# Altium schematic sheet MCU.SchDoc
size A3
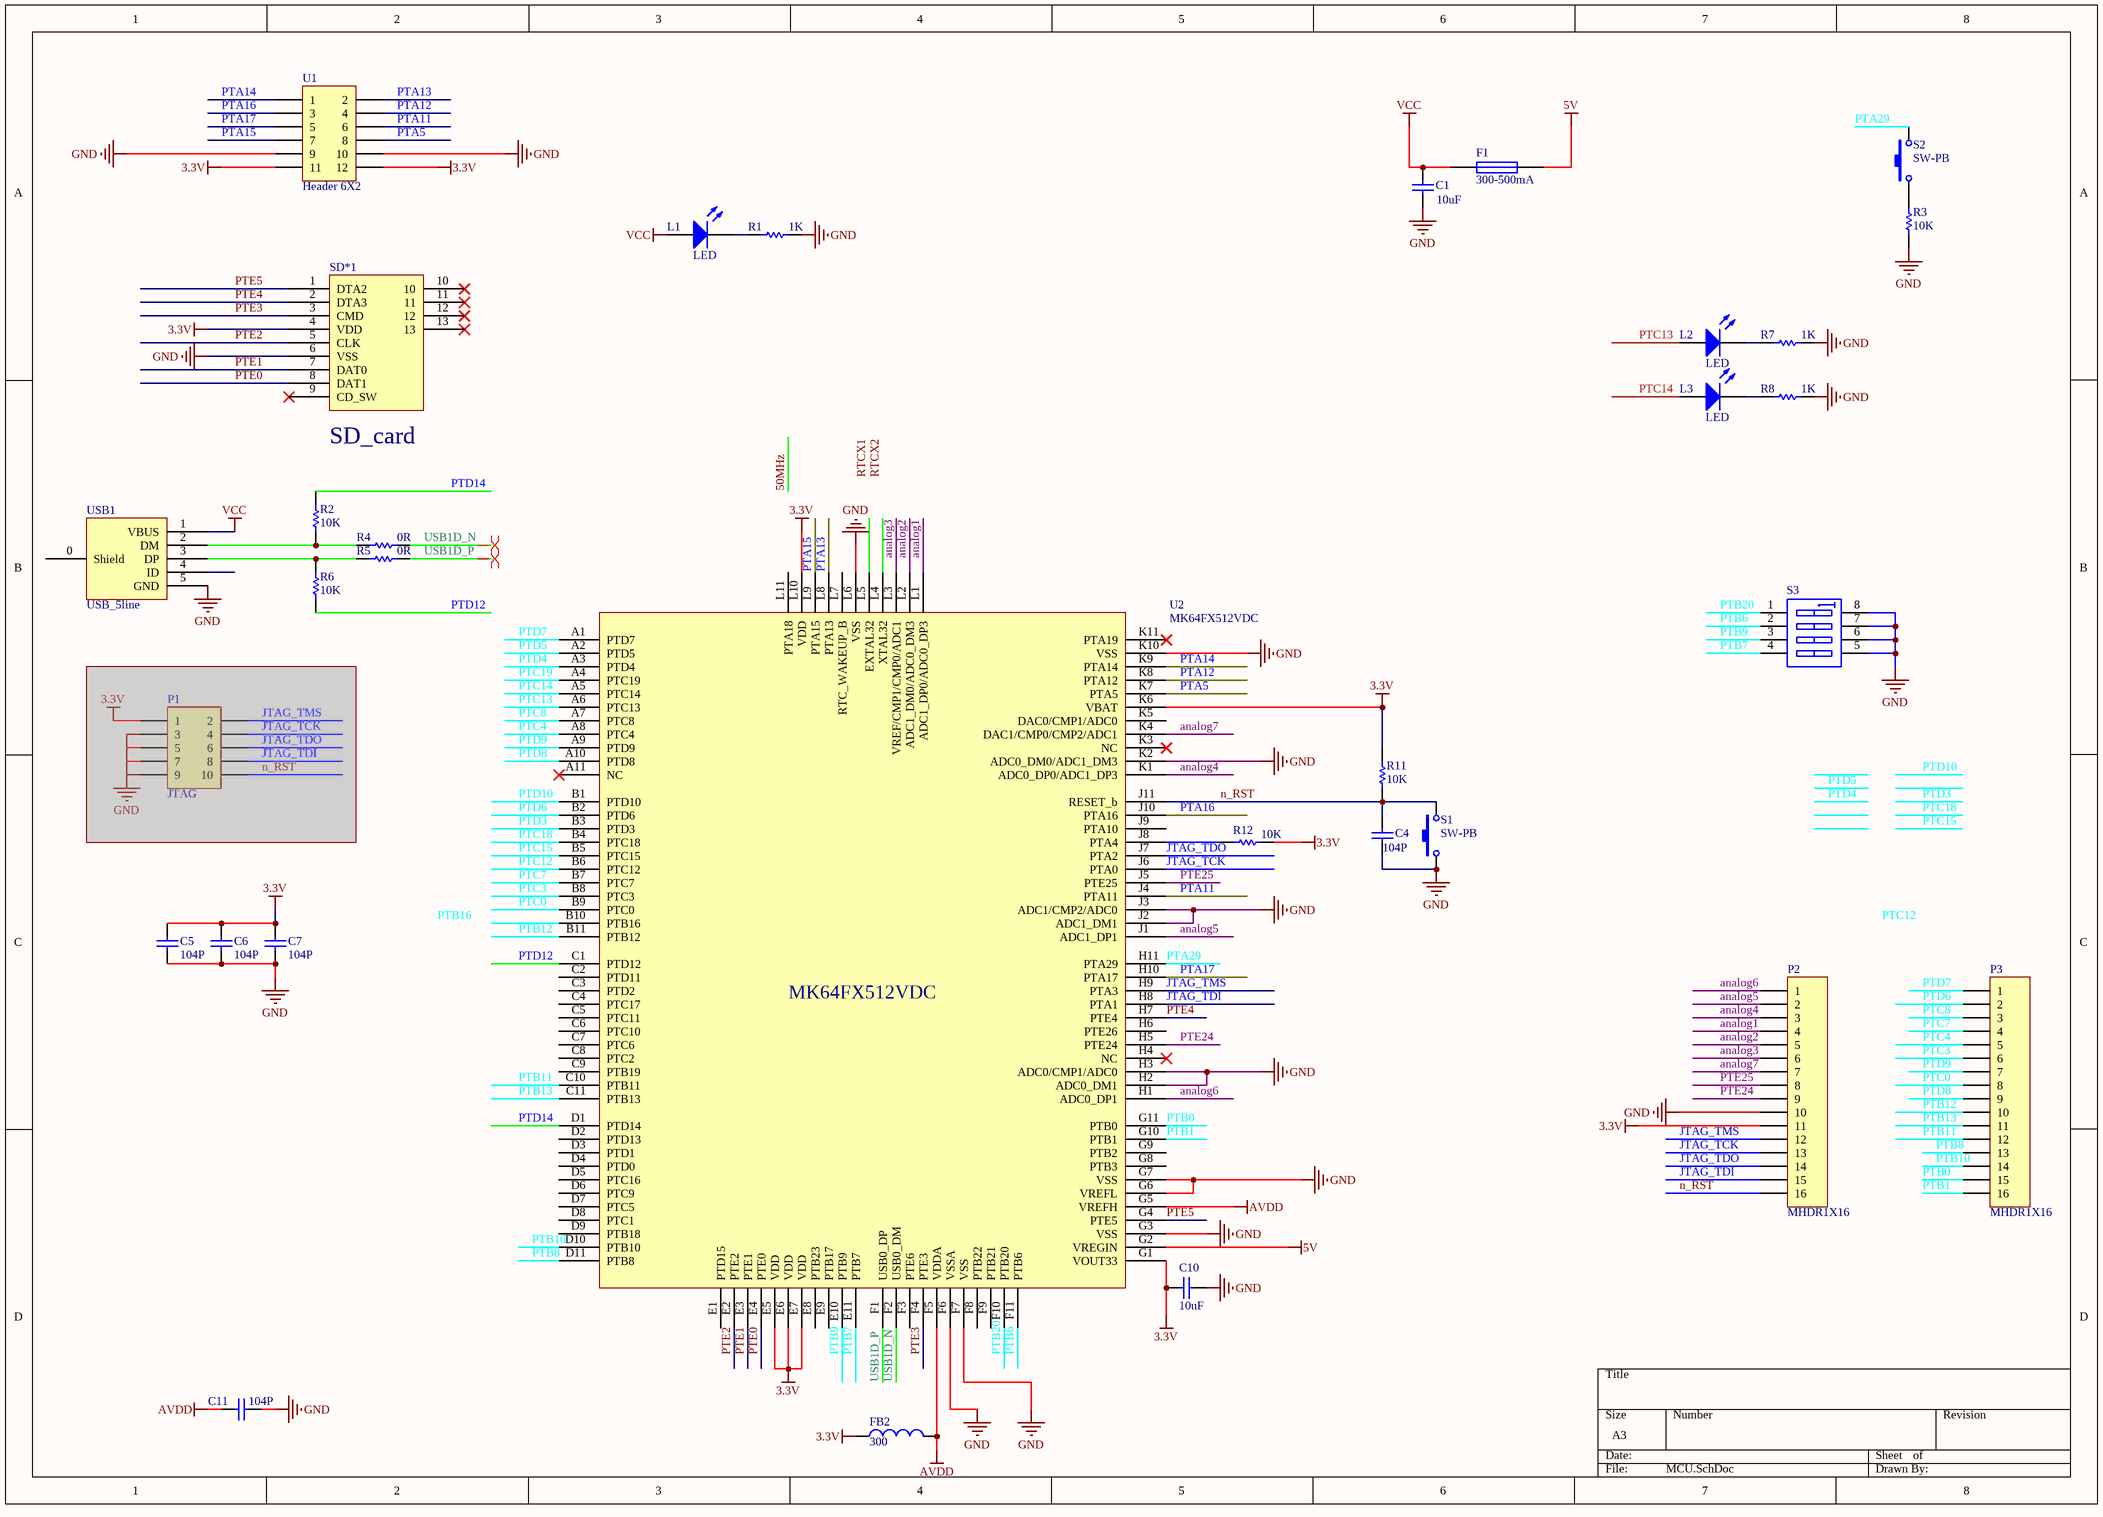
[diagram p0: MCU.SchDoc]

## Parts
C1  value 10uF  [1608[0603]]  (hidden comment: Cap)
C4  value 104P  [1608[0603]]  (hidden comment: Cap)
C5  value 104P  [0402]  (hidden comment: Cap)
C6  value 104P  [0402]  (hidden comment: Cap)
C7  value 104P  [0402]  (hidden comment: Cap)
C10  value 10uF  [1608[0603]]  (hidden comment: Cap)
C11  value 104P  [0402]  (hidden comment: Cap)
F1  300-500mA  [1206(2)]
FB2  value 300  [0402]  (hidden comment: Inductor)
L1  LED  [1608[0603]]
L2  LED  [1608[0603]]
L3  LED  [1608[0603]]
P1  JTAG  [MHDR2X5]  (masked out: inside a compile mask, not in the netlist)
P2  MHDR1X16  [MHDR1X16]
P3  MHDR1X16  [MHDR1X16]
R1  value 1K  [1608[0603]]  (hidden comment: Res)
R2  value 10K  [0402]  (hidden comment: Res)
R3  value 10K  [0402]  (hidden comment: Res)
R4  value 0R  [0402]  (hidden comment: Res)
R5  value 0R  [0402]  (hidden comment: Res)
R6  value 10K  [0402]  (hidden comment: Res)
R7  value 1K  [1608[0603]]  (hidden comment: Res)
R8  value 1K  [1608[0603]]  (hidden comment: Res)
R11  value 10K  [1608[0603]]  (hidden comment: Res)
R12  value 10K  [0402]  (hidden comment: Res)
S1  SW-PB  [key 3*4*2]
S2  SW-PB  [key 3*4*2]
S3  SW SMT-4  [SO8_N]  (value not drawn)
SD*1  TF_card  [TF卡座(短体)]  (value not drawn)
U1  Header 6X2  [HDR2X6]
U2  MK64FX512VDC  [BGA121C65P11X11_800X800X50]
USB1  USB_5line  [USB-4-A-SMT-A]

## Nets
3.3V: C5.2 C6.2 C7.2 C10.2 FB2.1 P2.11 R11.1 R12.1 SD*1.4(VDD) U1.11 U1.12 U2.E5(VDD) U2.E6(VDD) U2.E7(VDD) U2.G1(VOUT33) U2.K6(VBAT) U2.L10(VDD)
5V: F1.2 U2.G2(VREGIN)
AVDD: C11.1 FB2.2 U2.F5(VDDA) U2.G5(VREFH)
GND: C1.1 C4.1 C5.1 C6.1 C7.1 C10.1 C11.2 P2.10 R1.1 R3.2 R7.1 R8.1 S1.1 S3.5(B4) S3.6(B3) S3.7(B2) S3.8(B1) SD*1.6(VSS) U1.9 U1.10 U2.F6(VSSA) U2.F7(VSS) U2.G3(VSS) U2.G6(VREFL) U2.G7(VSS) U2.H2(ADC0_DM1) U2.H3(ADC0/CMP1/ADC0) U2.J2(ADC1_DM1) U2.J3(ADC1/CMP2/ADC0) U2.K2(ADC0_DM0/ADC1_DM3) U2.K10(VSS) U2.L6(VSS) USB1.5(GND)
VCC: C1.2 F1.1 L1.1(A) USB1.1(VBUS)
analog1: P2.4 U2.L1(ADC1_DP0/ADC0_DP3)
analog2: P2.5 U2.L2(ADC1_DM0/ADC0_DM3)
analog3: P2.6 U2.L3(VREF/CMP1/CMP0/ADC1)
analog4: P2.3 U2.K1(ADC0_DP0/ADC1_DP3)
analog5: P2.2 U2.J1(ADC1_DP1)
analog6: P2.1 U2.H1(ADC0_DP1)
analog7: P2.7 U2.K4(DAC1/CMP0/CMP2/ADC1)
JTAG_TCK: P2.13 U2.J6(PTA0)
JTAG_TDI: P2.15 U2.H8(PTA1)
JTAG_TDO: P2.14 U2.J7(PTA2)
JTAG_TMS: P2.12 U2.H9(PTA3)
n_RST: C4.2 P2.16 R11.2 S1.2 U2.J11(RESET_b)
PTA5: U1.8 U2.K7(PTA5)
PTA11: U1.6 U2.J4(PTA11)
PTA12: U1.4 U2.K8(PTA12)
PTA13: U1.2 U2.L8(PTA13)
PTA14: U1.1 U2.K9(PTA14)
PTA15: U1.7 U2.L9(PTA15)
PTA16: U1.3 U2.J10(PTA16)
PTA17: U1.5 U2.H10(PTA17)
PTA29: S2.2 U2.H11(PTA29)
PTB0: P3.15 U2.G11(PTB0)
PTB1: P3.16 U2.G10(PTB1)
PTB6: S3.2(A2) U2.F11(PTB6)
PTB7: S3.4(A4) U2.E11(PTB7)
PTB8: P3.13 U2.D11(PTB8)
PTB9: S3.3(A3) U2.E10(PTB9)
PTB10: P3.14 U2.D10(PTB10)
PTB11: P3.12 U2.C10(PTB11)
PTB12: P3.10 U2.B11(PTB12)
PTB13: P3.11 U2.C11(PTB13)
PTB20: S3.1(A1) U2.F10(PTB20)
PTC0: P3.8 U2.B9(PTC0)
PTC3: P3.6 U2.B8(PTC3)
PTC4: P3.5 U2.A8(PTC4)
PTC7: P3.4 U2.B7(PTC7)
PTC8: P3.3 U2.A7(PTC8)
PTC12: U2.B6(PTC12)
PTC13: L2.1(A) U2.A6(PTC13)
PTC14: L3.1(A) U2.A5(PTC14)
PTC15: U2.B5(PTC15)
PTC18: U2.B4(PTC18)
PTC19: U2.A4(PTC19)
PTD3: U2.B3(PTD3)
PTD4: U2.A3(PTD4)
PTD5: U2.A2(PTD5)
PTD6: P3.2 U2.B2(PTD6)
PTD7: P3.1 U2.A1(PTD7)
PTD8: P3.9 U2.A10(PTD8)
PTD9: P3.7 U2.A9(PTD9)
PTD10: U2.B1(PTD10)
PTD12: R6.2 U2.C1(PTD12)
PTD14: R2.1 U2.D1(PTD14)
PTE0: SD*1.8(DAT1) U2.E4(PTE0)
PTE1: SD*1.7(DAT0) U2.E3(PTE1)
PTE2: SD*1.5(CLK) U2.E2(PTE2)
PTE3: SD*1.3(CMD) U2.F4(PTE3)
PTE4: SD*1.2(DTA3) U2.H7(PTE4)
PTE5: SD*1.1(DTA2) U2.G4(PTE5)
PTE24: P2.9 U2.H5(PTE24)
PTE25: P2.8 U2.J5(PTE25)
USB1D_N: R4.1 U2.F2(USB0_DM)
USB1D_P: R5.1 U2.F1(USB0_DP)
NetL1_2: L1.2(K) R1.2
NetL2_2: L2.2(K) R7.2
NetL3_2: L3.2(K) R8.2
NetR2_2: R2.2 R4.2 USB1.2(DM)
NetR3_1: R3.1 S2.1
NetR5_2: R5.2 R6.1 USB1.3(DP)
NetR12_2: R12.2 U2.J8(PTA4)

Not connected (* = marked no-connect by the designer): SD*1 9(CD_SW)* 10* 11* 12* 13*; U2 A11(NC)* B10(PTB16) C2(PTD11) C3(PTD2) C4(PTC17) C5(PTC11) C6(PTC10) C7(PTC6) C8(PTC2) C9(PTB19) D2(PTD13) D3(PTD1) D4(PTD0) D5(PTC16) D6(PTC9) D7(PTC5) D8(PTC1) D9(PTB18) E1(PTD15) E8(PTB23) E9(PTB17) F3(PTE6) F8(PTB22) F9(PTB21) G8(PTB3) G9(PTB2) H4(NC)* H6(PTE26) J9(PTA10) K3(NC)* K5(DAC0/CMP1/ADC0) K11(PTA19)* L4(XTAL32) L5(EXTAL32) L7(RTC_WAKEUP_B) L11(PTA18); USB1 0(Shield) 4(ID)

## Layout directives
differential pair: USB1D_N, USB1D_P

## Notes on the sheet
- Labels drawn without touching a wire or pin: PTB16, PTC12, RTCX1, RTCX2
- (in symbol TF_card) SD_card

## Library data of the parts
C1 C4-C7 C10 C11 = Cap: 贴片电容; Published: 8-Jun-2000; LatestRevisionDate: 17-Jul-2002; LatestRevisionNote: Re-released for DXP Platform.; PackageReference: RAD-0.3; Publisher: Altium Limited
F1 = Fuse 1: Fuse; Published: 8-Jun-2000; LatestRevisionDate: 17-Jul-2002; LatestRevisionNote: Re-released for DXP Platform.; PackageReference: PIN-W2/E2.8; Publisher: Altium Limited
FB2 = Inductor: Code_IEC: 1005; Published: 8-Jun-2000; LatestRevisionDate: 29-May-2009; LatestRevisionNote: IPC-7351 Footprint Added.; PackageReference: 0402-A; Publisher: Altium Limited; PackageDescription: Chip Inductor; Code_JEITA: 0402
P1 = Header 5X2: Header, 5-Pin, Dual row; LatestRevisionDate: 17-Jul-2002; LatestRevisionNote: Re-released for DXP Platform.; Publisher: Altium Limited
P2 P3 = MHDR1X16: Header, 16-Pin; LatestRevisionDate: 17-Jul-2002; LatestRevisionNote: Re-released for DXP Platform.; Publisher: Altium Limited
R1-R8 R11 R12 = Res: 贴片电阻; Published: 8-Jun-2000; LatestRevisionDate: 17-Jul-2002; LatestRevisionNote: Re-released for DXP Platform.; PackageReference: AXIAL-0.3; Publisher: Altium Limited
S1 S2 = SW-PB: Switch
S3 = SW DIP-4: DIP Switch, 4 Position, SPST; Published: 24-Mar-1999; LatestRevisionDate: 29-May-2009; LatestRevisionNote: IPC-7351 Footprint Added.; PackageVersion: Dec-2002; PackageReference: SO8; Publisher: Altium Limited; PackageDescription: 8-Pin Small Outline Integrated Circuit 1.27 mm Pitch; Code_JEDEC: MS-012-AA; Code_IPC: SOIC127P600-8
U1 = Header 6X2: Header, 6-Pin, Dual row; LatestRevisionDate: 17-Jul-2002; LatestRevisionNote: Re-released for DXP Platform.; Publisher: Altium Limited
USB1 = USB_5line: pin to pad: 4>0 5>4